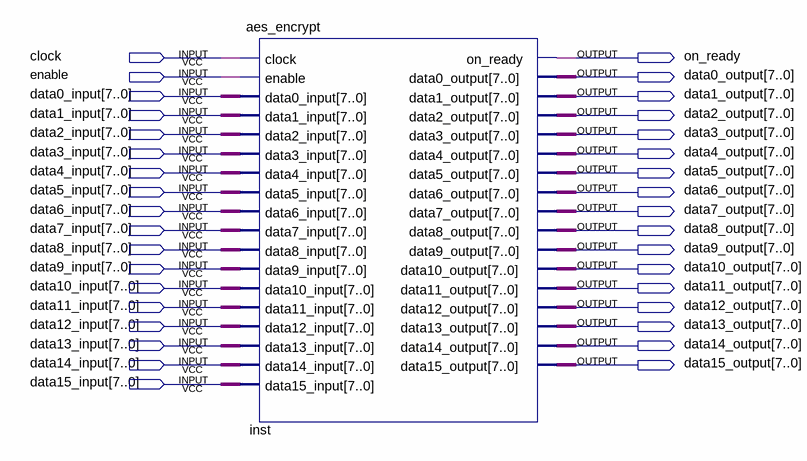
[diagram p0: schematic sheet]
// Quartus schematic aes_quartus.bdf as structural Verilog: 1 symbols, 35 pins
module aes_quartus (
  input  clock,
  input  enable,
  input  [7:0] data0_input,
  input  [7:0] data1_input,
  input  [7:0] data2_input,
  input  [7:0] data3_input,
  input  [7:0] data4_input,
  input  [7:0] data5_input,
  input  [7:0] data6_input,
  input  [7:0] data7_input,
  input  [7:0] data8_input,
  input  [7:0] data9_input,
  input  [7:0] data10_input,
  input  [7:0] data11_input,
  input  [7:0] data12_input,
  input  [7:0] data13_input,
  input  [7:0] data14_input,
  input  [7:0] data15_input,
  output on_ready,
  output [7:0] data0_output,
  output [7:0] data1_output,
  output [7:0] data2_output,
  output [7:0] data3_output,
  output [7:0] data4_output,
  output [7:0] data5_output,
  output [7:0] data6_output,
  output [7:0] data7_output,
  output [7:0] data8_output,
  output [7:0] data9_output,
  output [7:0] data10_output,
  output [7:0] data11_output,
  output [7:0] data12_output,
  output [7:0] data13_output,
  output [7:0] data14_output,
  output [7:0] data15_output
);

  aes_encrypt inst (
    .clock(clock), .enable(enable), .data0_input(data0_input), .data1_input(data1_input),
    .data2_input(data2_input), .data3_input(data3_input), .data4_input(data4_input),
    .data5_input(data5_input), .data6_input(data6_input), .data7_input(data7_input),
    .data8_input(data8_input), .data9_input(data9_input), .data10_input(data10_input),
    .data11_input(data11_input), .data12_input(data12_input), .data13_input(data13_input),
    .data14_input(data14_input), .data15_input(data15_input), .on_ready(on_ready),
    .data0_output(data0_output), .data1_output(data1_output), .data2_output(data2_output),
    .data3_output(data3_output), .data4_output(data4_output), .data5_output(data5_output),
    .data6_output(data6_output), .data7_output(data7_output), .data8_output(data8_output),
    .data9_output(data9_output), .data10_output(data10_output), .data11_output(data11_output),
    .data12_output(data12_output), .data13_output(data13_output), .data14_output(data14_output),
    .data15_output(data15_output));
endmodule
